# EAGLE schematic heater-control (EAGLE 5.00)

## Sheet 1 of 2
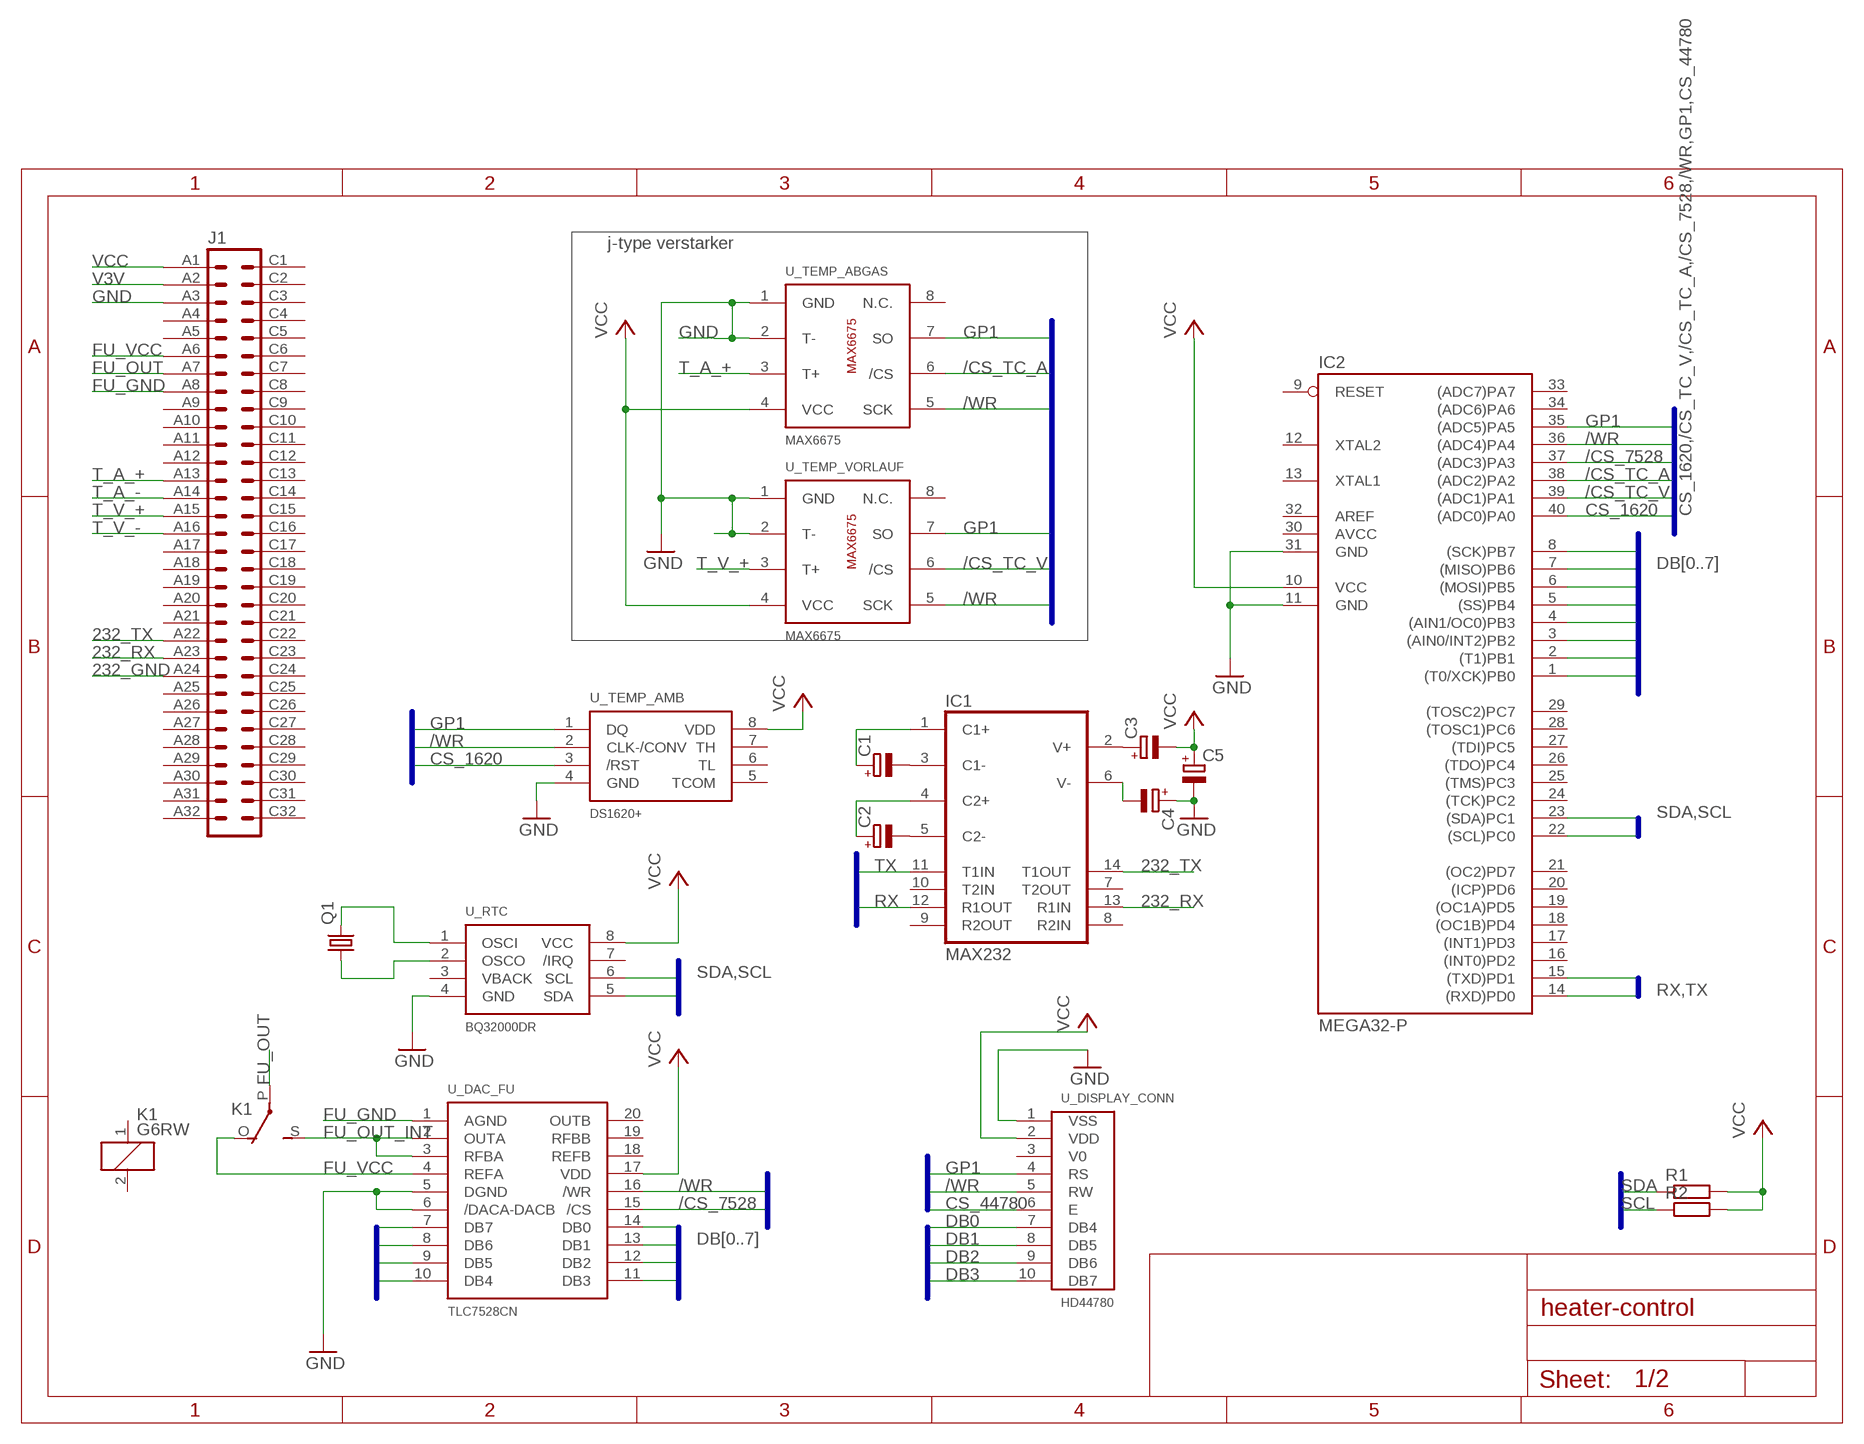
[diagram p0: schematic, sheet 1]

### Parts
C1  CPOL-EUE2-4  [E2-4]
C2  CPOL-EUE2-4  [E2-4]
C3  CPOL-EUE2-4  [E2-4]
C4  CPOL-EUE2-4  [E2-4]
C5  CPOL-EUE2-4  [E2-4]
IC1  MAX232  [DIL16]
IC2  MEGA32-P  [DIL40]
J1  VG64P  [VG64P]
K1  G6RW  [G6RW]
Q1  CRYSTALTC26V  [TC26V]
R1  R-EU_0204/5  [0204/5]
R2  R-EU_0204/5  [0204/5]
U_DAC_FU  TLC7528CN  [DIL20]
U_DISPLAY_CONN  HD44780  [1X10]
U_RTC  BQ32000DR  [SOIC8]
U_TEMP_ABGAS  MAX6675  [SOIC8]
U_TEMP_AMB  DS1620+  [DIL08]
U_TEMP_VORLAUF  MAX6675  [SOIC8]

### Nets
232_GND: J1.A24
232_RX: IC1.13(R1IN) J1.A23
232_TX: IC1.14(T1OUT) J1.A22
/CS_7528: IC2.37((ADC3)PA3) U_DAC_FU.15(/CS)
/CS_TC_A: IC2.38((ADC2)PA2) U_TEMP_ABGAS.6(/CS)
/CS_TC_V: IC2.39((ADC1)PA1) U_TEMP_VORLAUF.6(/CS)
/WR: IC2.36((ADC4)PA4) U_DAC_FU.16(/WR) U_DISPLAY_CONN.5(RW) U_TEMP_ABGAS.5(SCK) U_TEMP_AMB.2(CLK-/CONV) U_TEMP_VORLAUF.5(SCK)
CS_1620: IC2.40((ADC0)PA0) U_TEMP_AMB.3(/RST)
CS_44780: U_DISPLAY_CONN.6(E)
DB0: IC2.1((T0/XCK)PB0) U_DAC_FU.14(DB0) U_DISPLAY_CONN.7(DB4)
DB1: IC2.2((T1)PB1) U_DAC_FU.13(DB1) U_DISPLAY_CONN.8(DB5)
DB2: IC2.3((AIN0/INT2)PB2) U_DAC_FU.12(DB2) U_DISPLAY_CONN.9(DB6)
DB3: IC2.4((AIN1/OC0)PB3) U_DAC_FU.11(DB3) U_DISPLAY_CONN.10(DB7)
DB4: IC2.5((SS)PB4) U_DAC_FU.10(DB4)
DB5: IC2.6((MOSI)PB5) U_DAC_FU.9(DB5)
DB6: IC2.7((MISO)PB6) U_DAC_FU.8(DB6)
DB7: IC2.8((SCK)PB7) U_DAC_FU.7(DB7)
FU_GND: J1.A8 U_DAC_FU.1(AGND)
FU_OUT: J1.A7 K1.P(2:P)
FU_OUT_INT: K1.S(2:S) U_DAC_FU.2(OUTA) U_DAC_FU.3(RFBA)
FU_VCC: J1.A6 K1.O(2:O) U_DAC_FU.4(REFA)
GND: C4.+ C5.- IC2.11(GND) IC2.31(GND) J1.A3 U_DAC_FU.5(DGND) U_DAC_FU.6(/DACA-DACB) U_DISPLAY_CONN.1(VSS) U_RTC.4(GND) U_TEMP_ABGAS.1(GND) U_TEMP_ABGAS.2(T-) U_TEMP_AMB.4(GND) U_TEMP_VORLAUF.1(GND) U_TEMP_VORLAUF.2(T-)
GP1: IC2.35((ADC5)PA5) U_DISPLAY_CONN.4(RS) U_TEMP_ABGAS.7(SO) U_TEMP_AMB.1(DQ) U_TEMP_VORLAUF.7(SO)
N$1: C2.- IC1.5(C2-)
N$5: C2.+ IC1.4(C2+)
N$6: C1.- IC1.3(C1-)
N$7: C1.+ IC1.1(C1+)
N$9: C4.- IC1.6(V-)
N$11: C3.+ IC1.2(V+)
N$13: Q1.2 U_RTC.1(OSCI)
N$14: Q1.1 U_RTC.2(OSCO)
RX: IC1.12(R1OUT) IC2.14((RXD)PD0)
SCL: IC2.22((SCL)PC0) R2.1 U_RTC.6(SCL)
SDA: IC2.23((SDA)PC1) R1.1 U_RTC.5(SDA)
T_A_+: J1.A13 U_TEMP_ABGAS.3(T+)
T_A_-: J1.A14
T_V_+: J1.A15 U_TEMP_VORLAUF.3(T+)
T_V_-: J1.A16
TX: IC1.11(T1IN) IC2.15((TXD)PD1)
V3V: J1.A2
VCC: C3.- C5.+ IC2.10(VCC) J1.A1 R1.2 R2.2 U_DAC_FU.17(VDD) U_DISPLAY_CONN.2(VDD) U_RTC.8(VCC) U_TEMP_ABGAS.4(VCC) U_TEMP_AMB.8(VDD) U_TEMP_VORLAUF.4(VCC)
Unconnected: IC1.7(T2OUT) IC1.8(R2IN) IC1.9(R2OUT) IC1.10(T2IN) IC2.9(RESET) IC2.12(XTAL2) IC2.13(XTAL1) IC2.16((INT0)PD2) IC2.17((INT1)PD3) IC2.18((OC1B)PD4) IC2.19((OC1A)PD5) IC2.20((ICP)PD6) IC2.21((OC2)PD7) IC2.24((TCK)PC2) IC2.25((TMS)PC3) IC2.26((TDO)PC4) IC2.27((TDI)PC5) IC2.28((TOSC1)PC6) IC2.29((TOSC2)PC7) IC2.32(AREF) IC2.33((ADC7)PA7) IC2.34((ADC6)PA6) J1.A4 J1.A5 J1.A9 J1.A10 J1.A11 J1.A12 J1.A17 J1.A18 J1.A19 J1.A20 J1.A21 J1.A25 J1.A26 J1.A27 J1.A28 J1.A29 J1.A30 J1.A31 J1.A32 J1.C1 J1.C2 J1.C3 J1.C4 J1.C5 J1.C6 J1.C7 J1.C8 J1.C9 J1.C10 J1.C11 J1.C12 J1.C13 J1.C14 J1.C15 J1.C16 J1.C17 J1.C18 J1.C19 J1.C20 J1.C21 J1.C22 J1.C23 J1.C24 J1.C25 J1.C26 J1.C27 J1.C28 J1.C29 J1.C30 J1.C31 J1.C32 K1.1 K1.2 U_DAC_FU.18(REFB) U_DAC_FU.19(RFBB) U_DAC_FU.20(OUTB) U_RTC.7(/IRQ) U_TEMP_ABGAS.8(N.C.) U_TEMP_AMB.5(TCOM) U_TEMP_AMB.6(TL) U_TEMP_AMB.7(TH) U_TEMP_VORLAUF.8(N.C.)

### Buses
DB[0..7]
RX,TX
SDA,SCL
CS_1620,/CS_TC_V,/CS_TC_A,/CS_7528,/WR,GP1,CS_44780

### Notes on the sheet
- j-type verstarker

## Sheet 2 of 2

## Power pins joined to a net without a drawn wire
AVCC: IC2.30(AVCC)
GND: IC1.15(GND)
V0: U_DISPLAY_CONN.3(V0)
VBACK: U_RTC.3(VBACK)
VCC: IC1.16(VCC)

## Library data of the parts
C1-C5 = resistor:CPOL-EU: POLARIZED CAPACITOR, European symbol
IC1 = maxim:MAX232: RS232 TRANSEIVER
IC2 = atmel:MEGA32-P: MICROCONTROLLER 32 Kbytes FLASH 2 Kbytes SRAM 1 Kbytes EEPROM USART 8-channel 10 bit ADC Source: www.atmel.com .. doc2503.pdf
J1 = 19inch:VG64: PCB EUROCARD, 64-pin type C/AC, 2.54 mm
K1 = relay:G6RW: RELAY 1 x switch, Omron
Q1 = crystal:CRYSTAL: CRYSTAL
R1 R2 = resistor:R-EU_: RESISTOR, European symbol
U_DAC_FU = mru-led:TLC7528CN
U_DISPLAY_CONN = mru-led:HD44780: LCD Display Connector 4-bit databus fuer HD44780 display
U_RTC = mru-led:BQ32000DR: ic srl real time clock 8soic
U_TEMP_ABGAS U_TEMP_VORLAUF = mru-led:MAX6675
U_TEMP_AMB = mru-led:DS1620+